# Altium schematic sheet Safety Loops.SchDoc
size A4
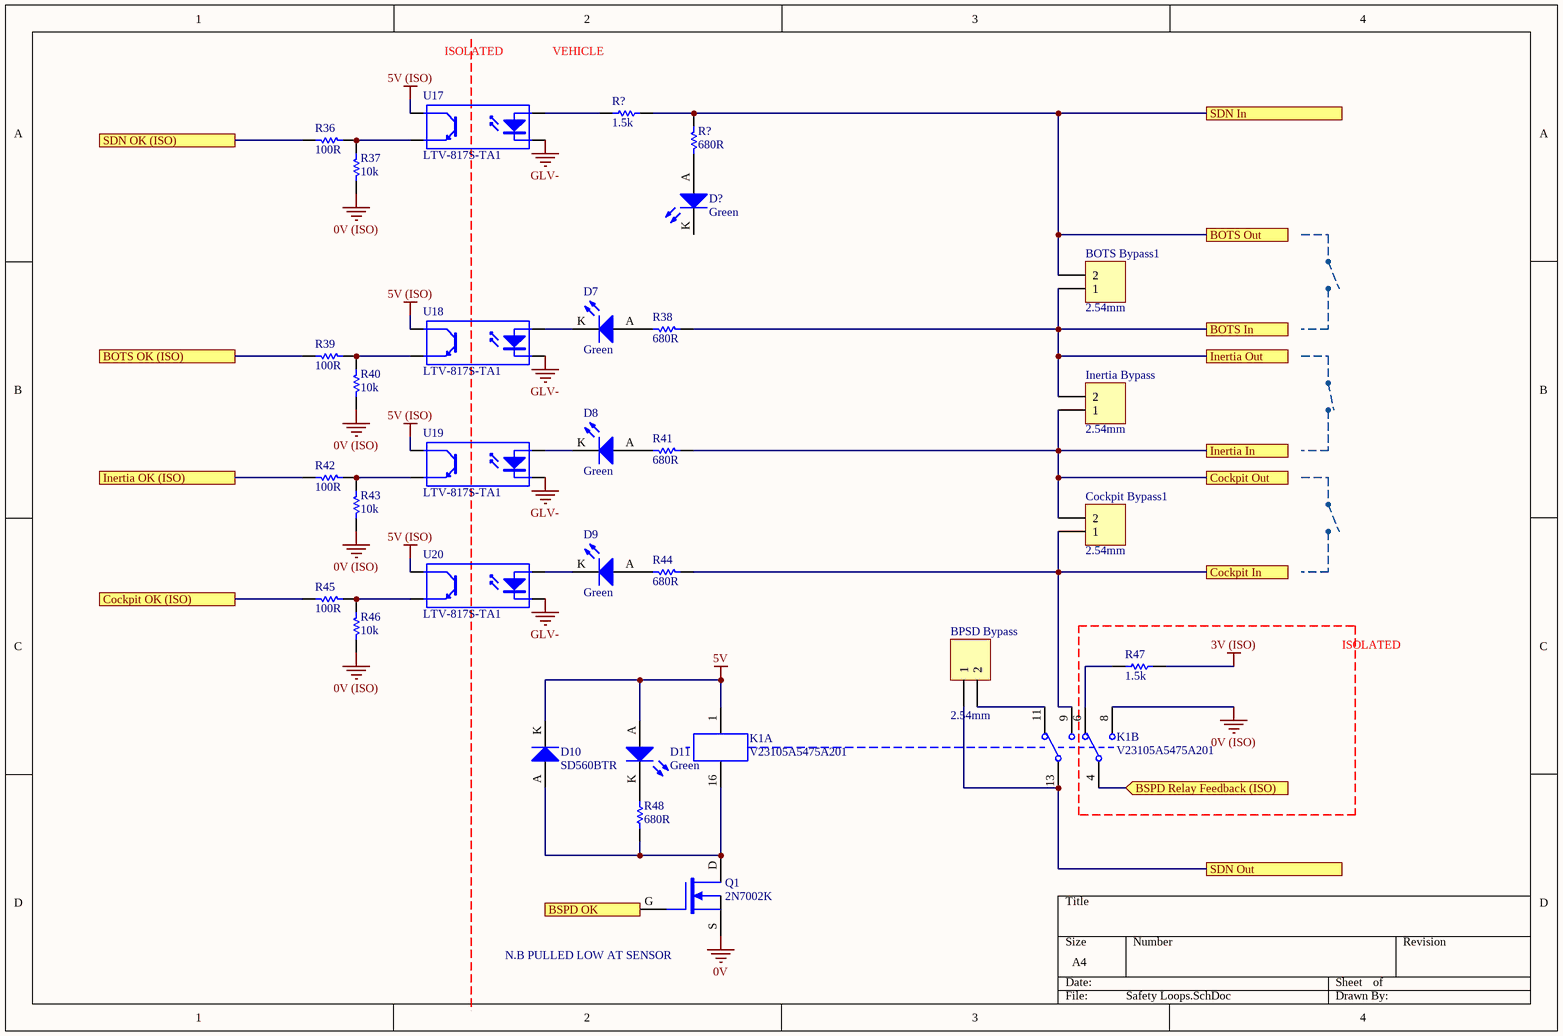
[diagram p0: Safety Loops.SchDoc]

## Parts
(Parts that share a designator on the sheet are numbered #1, #2 ... from top to bottom, then left to right.)
BOTS_Bypass1  2.54mm  [TH 2.54mm Header 1x2]
BPSD_Bypass  2.54mm  [TH 2.54mm Header 1x2]
Cockpit_Bypass1  2.54mm  [TH 2.54mm Header 1x2]
D7  Green  [0805 LED]
D8  Green  [0805 LED]
D9  Green  [0805 LED]
D10  SD560BTR  [SMB Diode]
D11  Green  [0805 LED]
D?  Green  [0805 LED]
Inertia_Bypass  2.54mm  [TH 2.54mm Header 1x2]
K1  V23105A5475A201  [TI 2-DIL]  (parts A,B of 2)
Q1  2N7002K  [SOT-343_N]
R36  100R  [0805]
R37  10k  [0805]
R38  680R  [0805]
R39  100R  [0805]
R40  10k  [0805]
R41  680R  [0805]
R42  100R  [0805]
R43  10k  [0805]
R44  680R  [0805]
R45  100R  [0805]
R46  10k  [0805]
R47  1.5k  [0805]
R48  680R  [0805]
R?#1  1.5k  [0805]
R?#2  680R  [0805]
U17  LTV-817S-TA1  [ON 4-SMD]
U18  LTV-817S-TA1  [ON 4-SMD]
U19  LTV-817S-TA1  [ON 4-SMD]
U20  LTV-817S-TA1  [ON 4-SMD]

## Blocks framed on the sheet
ISOLATED: K1 R47

## Ports
BOTS In, BOTS OK (ISO), BOTS Out, BSPD OK, BSPD Relay Feedback (ISO) (in), Cockpit In, Cockpit OK (ISO), Cockpit Out, Inertia In, Inertia OK (ISO), Inertia Out, SDN In, SDN OK (ISO), SDN Out

## Nets
0V: Q1.S
0V (ISO): K1.8 R37.1 R40.1 R43.1 R46.1
3V (ISO): R47.2
5V: D10.K D11.A K1.1
5V (ISO): U17.4(C) U18.4(C) U19.4(C) U20.4(C)
GLV-: U17.2(K) U18.2(K) U19.2(K) U20.2(K)
BOTS In: BOTS_Bypass1.1 Inertia_Bypass.2 R38.2 ; port Inertia Out, port BOTS In
BOTS OK (ISO): R39.2 ; port BOTS OK (ISO)
BOTS Out: BOTS_Bypass1.2 R?#1.2 R?#2.2 ; port BOTS Out, port SDN In
BSPD OK: Q1.G ; port BSPD OK
BSPD Relay Feedback (ISO): K1.4 ; port BSPD Relay Feedback (ISO)
Cockpit In: Cockpit_Bypass1.1 K1.9 R44.2 ; port Cockpit In
Cockpit OK (ISO): R45.2 ; port Cockpit OK (ISO)
Cockpit Out: Cockpit_Bypass1.2 Inertia_Bypass.1 R41.2 ; port Cockpit Out, port Inertia In
Inertia OK (ISO): R42.2 ; port Inertia OK (ISO)
SDN OK (ISO): R36.2 ; port SDN OK (ISO)
SDN Out: BPSD_Bypass.1 K1.13 ; port SDN Out
NetBPSD_Bypass_2: BPSD_Bypass.2 K1.11
NetD7_A: D7.A R38.1
NetD7_K: D7.K U18.1(A)
NetD8_A: D8.A R41.1
NetD8_K: D8.K U19.1(A)
NetD9_A: D9.A R44.1
NetD9_K: D9.K U20.1(A)
NetD10_A: D10.A K1.16 Q1.D R48.1
NetD11_K: D11.K R48.2
NetD?_A: D?.A R?#2.1
NetK1_6: K1.6 R47.1
NetR36_1: R36.1 R37.2 U17.3(E)
NetR39_1: R39.1 R40.2 U18.3(E)
NetR42_1: R42.1 R43.2 U19.3(E)
NetR45_1: R45.1 R46.2 U20.3(E)
NetR?#1_1: R?#1.1 U17.1(A)

Not connected (* = marked no-connect by the designer): D? K

## Notes on the sheet
- ISOLATED
- VEHICLE
- (near Q1) N.B PULLED LOW AT SENSOR

## Library data of the parts
BOTS_Bypass1 BPSD_Bypass Cockpit_Bypass1 Inertia_Bypass = TH 2.54mm Header 1x2: Positions: 2; Angle: 0; Flange: No; Contact: NA; Part Number: TH 2.54mm Header 1x2; Pitch: 2.54mm; Row Spacing: 2.54mm
D7-D9 D11 D? = SML-210FTT86: Green LED Indication - Discrete 1.75V 0805 (2012 Metric); Manufacturer: ROHM Semiconductor; Part Number: SML-210FTT86; Colour: Green; Digikey Part Number: 511-1285-1-ND; Digikey Link: https://www.digikey.com/product-detail/en/rohm-semiconductor/SML-210FTT86/511-1285-1-ND/637098
D10 = SD560BTR: 1.2V_F 600V 5A SMB; Manufacturer: SMC Diode Solutions; Part Number: SD560BTR; Digikey Part Number: 1655-1530-2-ND; Digikey Link: https://www.digikey.com/product-detail/en/smc-diode-solutions/SD560BTR/1655-1530-2-ND/6022620
K1 = V23105A5475A201: 5V DPDT Relay 3A 220VDC; Manufacturer: Axicom; Part Number: V23105A5475A201; Digikey Part Number: PB383-ND; Digikey Link: https://www.digikey.com/products/en?mpart=V23105A5001A201&v=41
Q1 = 2N7002K: 60V 380mA, NFET MOSTFET (Small Signal); Manufacturer: ON Semiconductor; Published: 24-Mar-1999; LatestRevisionDate: 29-May-2009; LatestRevisionNote: IPC-7351 Footprint Added.; PackageVersion: Sep-2000; PackageReference: SOT-343; Publisher: Altium Limited; PackageDescription: 4-Pin SOT-343 Package 1.3 mm Pitch, 2.1 mm Lead Span; Part Number: 2N7002K; Digikey Part Number: 2N7002KCT-ND; Digikey Link: https://www.digikey.com/product-detail/en/on-semiconductor/2N7002K/2N7002KCT-ND/2060375; Qty: 30
R36 R39 R42 R45 = RC0805FR07100RL: Manufacturer: YAGEO; Tolerance: 0.01; Rated Voltage: 0.125W; Part Number: RC0805FR07100RL; Value: 100R; Material: FR-07
R37 R40 R43 R46 = RC0805FR0710KL: Manufacturer: YAGEO; Tolerance: 0.01; Rated Voltage: 0.125W; Part Number: RC0805FR0710KL; Value: 10k; Material: FR-07
R38 R41 R44 R48 R?#2 = RC0805FR07680RL: Manufacturer: YAGEO; Tolerance: 0.01; Rated Voltage: 0.125W; Part Number: RC0805FR07680RL; Value: 680R; Material: FR-07
R47 R?#1 = RC0805FR071K5L: Manufacturer: YAGEO; Tolerance: 0.01; Rated Voltage: 0.125W; Part Number: RC0805FR071K5L; Value: 1.5k; Material: FR-07
U17-U20 = LTV-817S-TA1: 35V 50ma Optocoupler (VF=1.2V); Manufacturer: Lite-On Inc; Part Number: LTV-817S-TA1; Digikey Part Number: 160-1893-2-ND; Digikey Link: https://www.digikey.com/product-detail/en/lite-on-inc/LTV-817S-TA1/160-1893-2-ND/388451